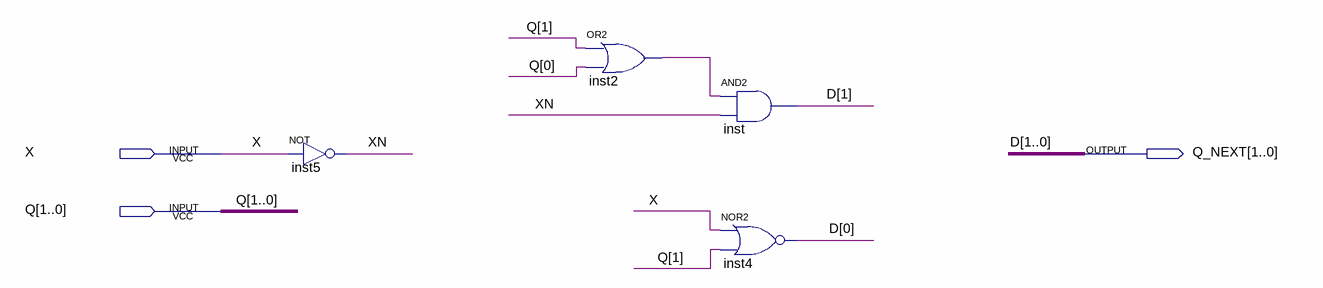
[diagram p0: schematic sheet]
// Quartus schematic NEXT_STATE_2.bdf as structural Verilog: 4 symbols, 3 pins
module NEXT_STATE_2 (
  input  X,
  input  [1:0] Q,
  output [1:0] Q_NEXT
);

  wire inst2_out, XN;

  not inst5 (XN, X);
  or inst2 (inst2_out, Q[1], Q[0]);
  and inst (Q_NEXT[1], inst2_out, XN);
  nor inst4 (Q_NEXT[0], X, Q[1]);

  // Other names for the same wires on the sheet: D[1:0] = Q_NEXT
endmodule
